# EAGLE design PhD_HAT_Pi (EAGLE 9.4.1)

## Sheet 1 of 2
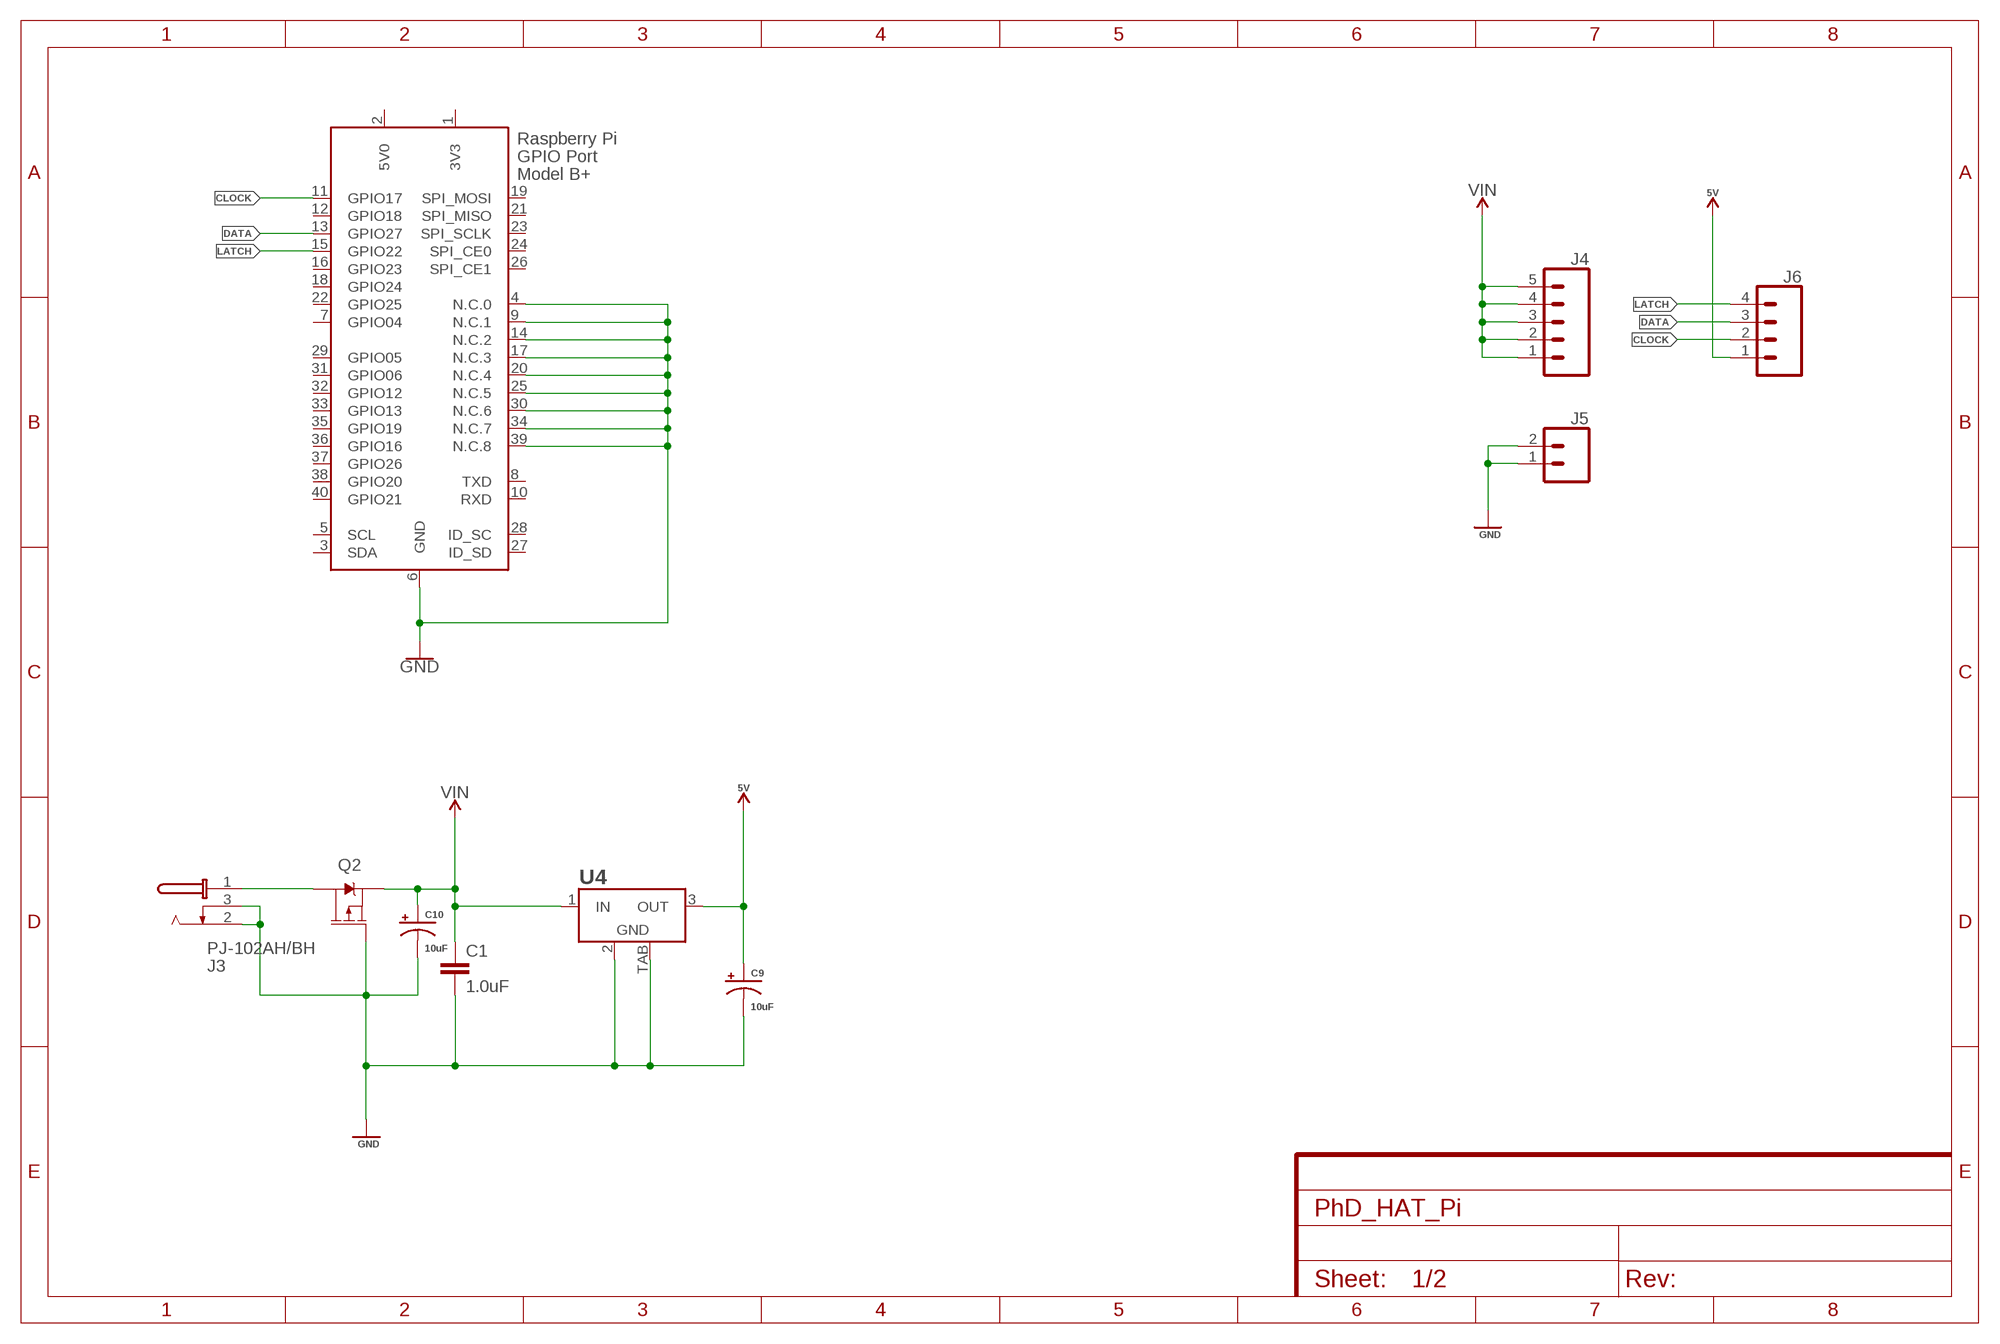
[diagram p0: schematic, sheet 1]

### Parts
C1  1.0uF  1.0UF-0603-16V-10%  [0603]
C9  10uF  10UF-POLAR-EIA3216-16V-10%(TANT)  [EIA3216]
C10  10uF  10UF-POLAR-EIA3216-16V-10%(TANT)  [EIA3216]
J3  PJ-102AH/BH  [PJ-102XH]
J4  CONN_05SCREW  [SCREWTERMINAL-3.5MM-5]
J5  CONN_023.5MM  [SCREWTERMINAL-3.5MM-2]
J6  CONN_04SCREW  [SCREWTERMINAL-3.5MM-4]
Q2  2.5A/30V/105mΩ  MOSFET_PCH-DMG2307L  [SOT23-3]
U4  MIC39100-5.0WS  [SOT223]
X1  RASPI_BOARD_B+_H  [RASPI_BOARD_B+HAT]

### Nets
5V: C9.+ J6.1 U4.3(OUT)
CLOCK: J6.2 X1.11(GPIO17)
DATA: J6.3 X1.13(GPIO27)
GND: C1.2 C9.- C10.- J3.2(S) J3.3(SS) J5.1 J5.2 Q2.1(G) U4.2(GND) U4.TAB(GND) X1.4(N.C.0) X1.6(GND) X1.9(N.C.1) X1.14(N.C.2) X1.17(N.C.3) X1.20(N.C.4) X1.25(N.C.5) X1.30(N.C.6) X1.34(N.C.7) X1.39(N.C.8)
LATCH: J6.4 X1.15(GPIO22)
N$9: J3.1(T) Q2.3(D)
VIN: C1.1 C10.+ J4.1 J4.2 J4.3 J4.4 J4.5 Q2.2(S) U4.1(IN)
Unconnected: X1.3(SDA) X1.5(SCL) X1.7(GPIO04) X1.8(TXD) X1.10(RXD) X1.12(GPIO18) X1.16(GPIO23) X1.18(GPIO24) X1.19(SPI_MOSI) X1.21(SPI_MISO) X1.22(GPIO25) X1.23(SPI_SCLK) X1.24(SPI_CE0) X1.26(SPI_CE1) X1.27(ID_SD) X1.28(ID_SC) X1.29(GPIO05) X1.31(GPIO06) X1.32(GPIO12) X1.33(GPIO13) X1.35(GPIO19) X1.36(GPIO16) X1.37(GPIO26) X1.38(GPIO20) X1.40(GPIO21)

## Sheet 2 of 2
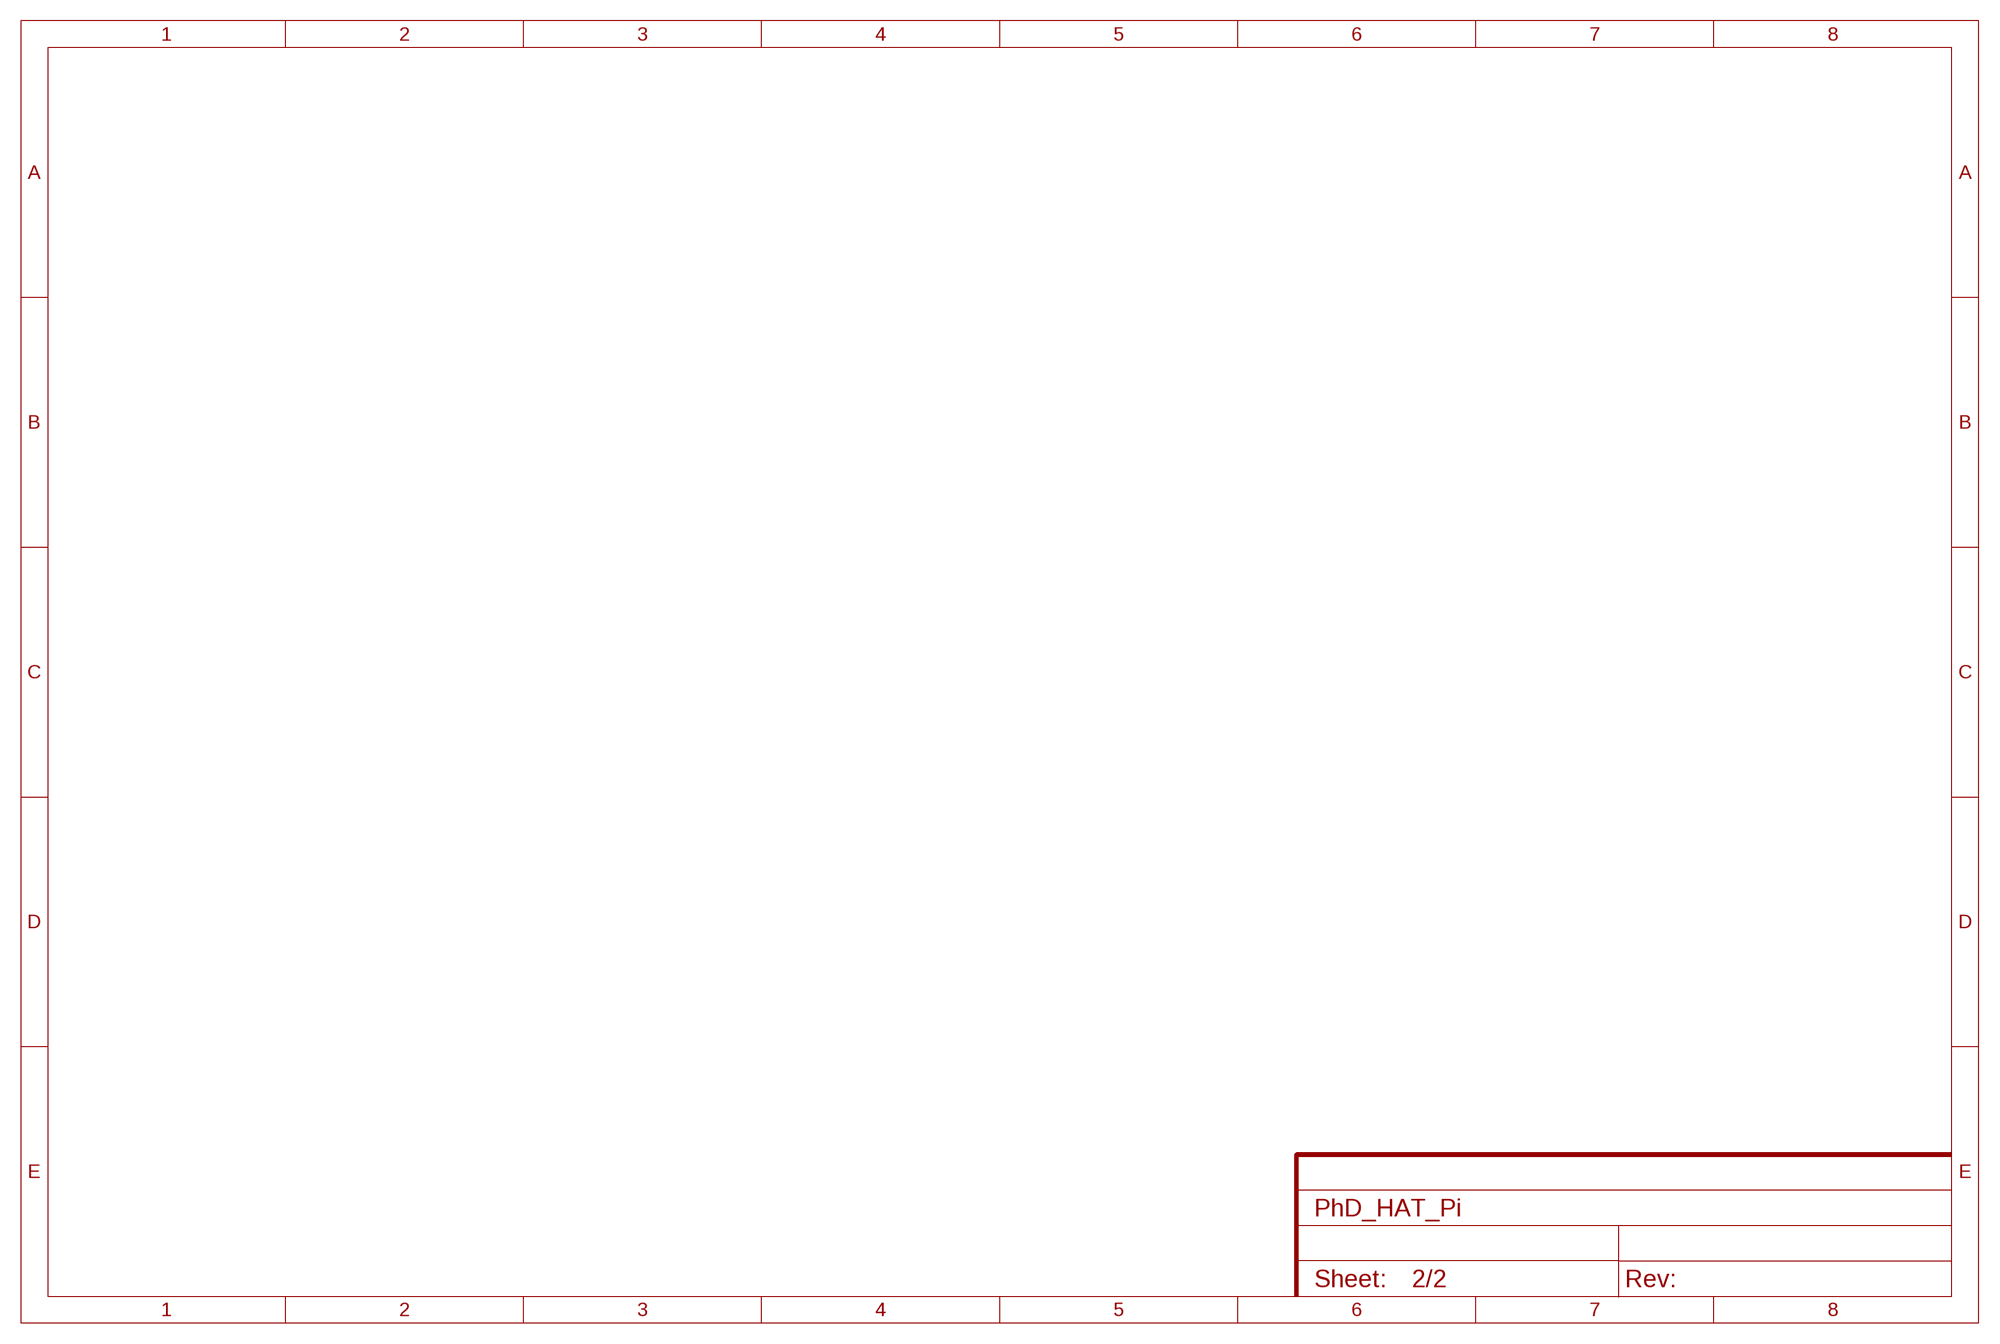
[diagram p1: schematic, sheet 2]

## Power pins joined to a net without a drawn wire
3V3: X1.1(3V3)
5V0: X1.2(5V0)

## Library data of the parts
C1 = SparkFun-Capacitors:1.0UF: 1µF ceramic capacitors A capacitor is a passive two-terminal electrical component used to store electrical energy temporarily in an electric field.; PROD_ID: CAP-00868
C9 C10 = SparkFun-Capacitors:10UF-POLAR: 10.0µF polarized capacitors A capacitor is a passive two-terminal electrical component used to store electrical energy temporarily in an electric field.; PROD_ID: CAP-00811
J3 = con-cuistack:PJ-102AH/BH: DC Power Jack PJ-102AH (2.1 x 5.5 MM) PJ-102BH (2.5 x 5.5 MM)
J4 = SparkFun-Connectors:CONN_05: Multi connection point. Often used as Generic Header-pin footprint for 0.1 inch spaced/style header connections On any of the 0.1 inch spaced packages, you can populate with these: Break Away Headers - Straight <https://www.sparkfun.com/products/116> (PRT-00116) Break Away Male Headers - Right Angle <https://www.sparkfun.com/products/553> (PRT-00553) Female Headers <https://www.sparkfun.com/products/115> (PRT-00115) Break Away Headers - Machine Pin <https://www.sparkfun.com/products/117> (PRT-00117) Break Away Female Headers - Swiss Machine Pin <https://www.sparkfun.com/products/743> (PRT-00743) For SCREWTERMINALS and SPRING TERMINALS visit here: Screw Terimnals on SparkFun.com <https://www.sparkfun.com/search/results?term=Screw+Terminals> (5mm/3.5mm/2.54mm spacing) This device is also useful as a general connection point to wire up your design to another part of your project. Our various solder wires solder well into these plated through hole pads. Hook-Up Wire - Assortment (Stranded, 22 AWG) <https://www.sparkfun.com/products/11375> (PRT-11375) Hook-Up Wire - Assortment (Solid Core, 22 AWG) <https://www.sparkfun.com/products/11367> (PRT-11367) View the entire wire category on our website here <https://www.sparkfun.com/categories/141> Special notes: Molex polarized connector foot print use with SKU : PRT-08231 with associated crimp pins and housings. 1MM SMD Version SKU: PRT-10208; PROD_ID: Combine 8288+8399
J5 = SparkFun-Connectors:CONN_02: Multi connection point. Often used as Generic Header-pin footprint for 0.1 inch spaced/style header connections On any of the 0.1 inch spaced packages, you can populate with these: Break Away Headers - Straight <https://www.sparkfun.com/products/116> (PRT-00116) Break Away Male Headers - Right Angle <https://www.sparkfun.com/products/553> (PRT-00553) Female Headers <https://www.sparkfun.com/products/115> (PRT-00115) Break Away Headers - Machine Pin <https://www.sparkfun.com/products/117> (PRT-00117) Break Away Female Headers - Swiss Machine Pin <https://www.sparkfun.com/products/743> (PRT-00743) For SCREWTERMINALS and SPRING TERMINALS visit here: Screw Terimnals on SparkFun.com <https://www.sparkfun.com/search/results?term=Screw+Terminals> (5mm/3.5mm/2.54mm spacing) This device is also useful as a general connection point to wire up your design to another part of your project. Our various solder wires solder well into these plated through hole pads. Hook-Up Wire - Assortment (Stranded, 22 AWG) <https://www.sparkfun.com/products/11375> (PRT-11375) Hook-Up Wire - Assortment (Solid Core, 22 AWG) <https://www.sparkfun.com/products/11367> (PRT-11367) View the entire wire category on our website here <https://www.sparkfun.com/categories/141> Special notes: Molex polarized connector foot print use with: PRT-08233 with associated crimp pins and housings. 2.54_SCREWTERM for use with PRT-10571. 3.5mm Screw Terminal footprints for PRT-08084 5mm Screw Terminal footprints for use with PRT-08432; PROD_ID: CONN-08399
J6 = SparkFun-Connectors:CONN_04: Multi connection point. Often used as Generic Header-pin footprint for 0.1 inch spaced/style header connections On any of the 0.1 inch spaced packages, you can populate with these: Break Away Headers - Straight <https://www.sparkfun.com/products/116> (PRT-00116) Break Away Male Headers - Right Angle <https://www.sparkfun.com/products/553> (PRT-00553) Female Headers <https://www.sparkfun.com/products/115> (PRT-00115) Break Away Headers - Machine Pin <https://www.sparkfun.com/products/117> (PRT-00117) Break Away Female Headers - Swiss Machine Pin <https://www.sparkfun.com/products/743> (PRT-00743) For SCREWTERMINALS and SPRING TERMINALS visit here: Screw Terimnals on SparkFun.com <https://www.sparkfun.com/search/results?term=Screw+Terminals> (5mm/3.5mm/2.54mm spacing) This device is also useful as a general connection point to wire up your design to another part of your project. Our various solder wires solder well into these plated through hole pads. Hook-Up Wire - Assortment (Stranded, 22 AWG) <https://www.sparkfun.com/products/11375> (PRT-11375) Hook-Up Wire - Assortment (Solid Core, 22 AWG) <https://www.sparkfun.com/products/11367> (PRT-11367) View the entire wire category on our website here <https://www.sparkfun.com/categories/141> Special notes: Molex polarized connector foot print use with SKU : PRT-08231 with associated crimp pins and housings. 1MM SMD Version SKU: PRT-10208; PROD_ID: 2xCONN-08399; SF_ID: 2xPRT-08084
Q2 = SparkFun-DiscreteSemi:MOSFET_PCH: P-channel MOSFETs Voltage controlled devices that allow control of high current outputs. SparkFun Products: SparkFun ESP32 Thing <https://www.sparkfun.com/products/13907> SparkFun ESP8266 Thing <https://www.sparkfun.com/products/13231>; PROD_ID: TRANS-11308
U4 = MIC39100-5.0WS:MIC39100-5.0WS; AVAILABILITY: Unavailable; DESCRIPTION: LDO Regulator Pos 5V 1A; MF: Micrel; MP: MIC39100-5.0WS; PACKAGE: SOT-223 Micrel; PRICE: None
X1 = raspberrypi_bastelstube_v13:RASPI_BOARD_B+: Raspberry Pi GPIO connector with markings for the outer dimensions of the Raspberry Pi board model B+ with different sets of drill holes or mounting pads

## Board
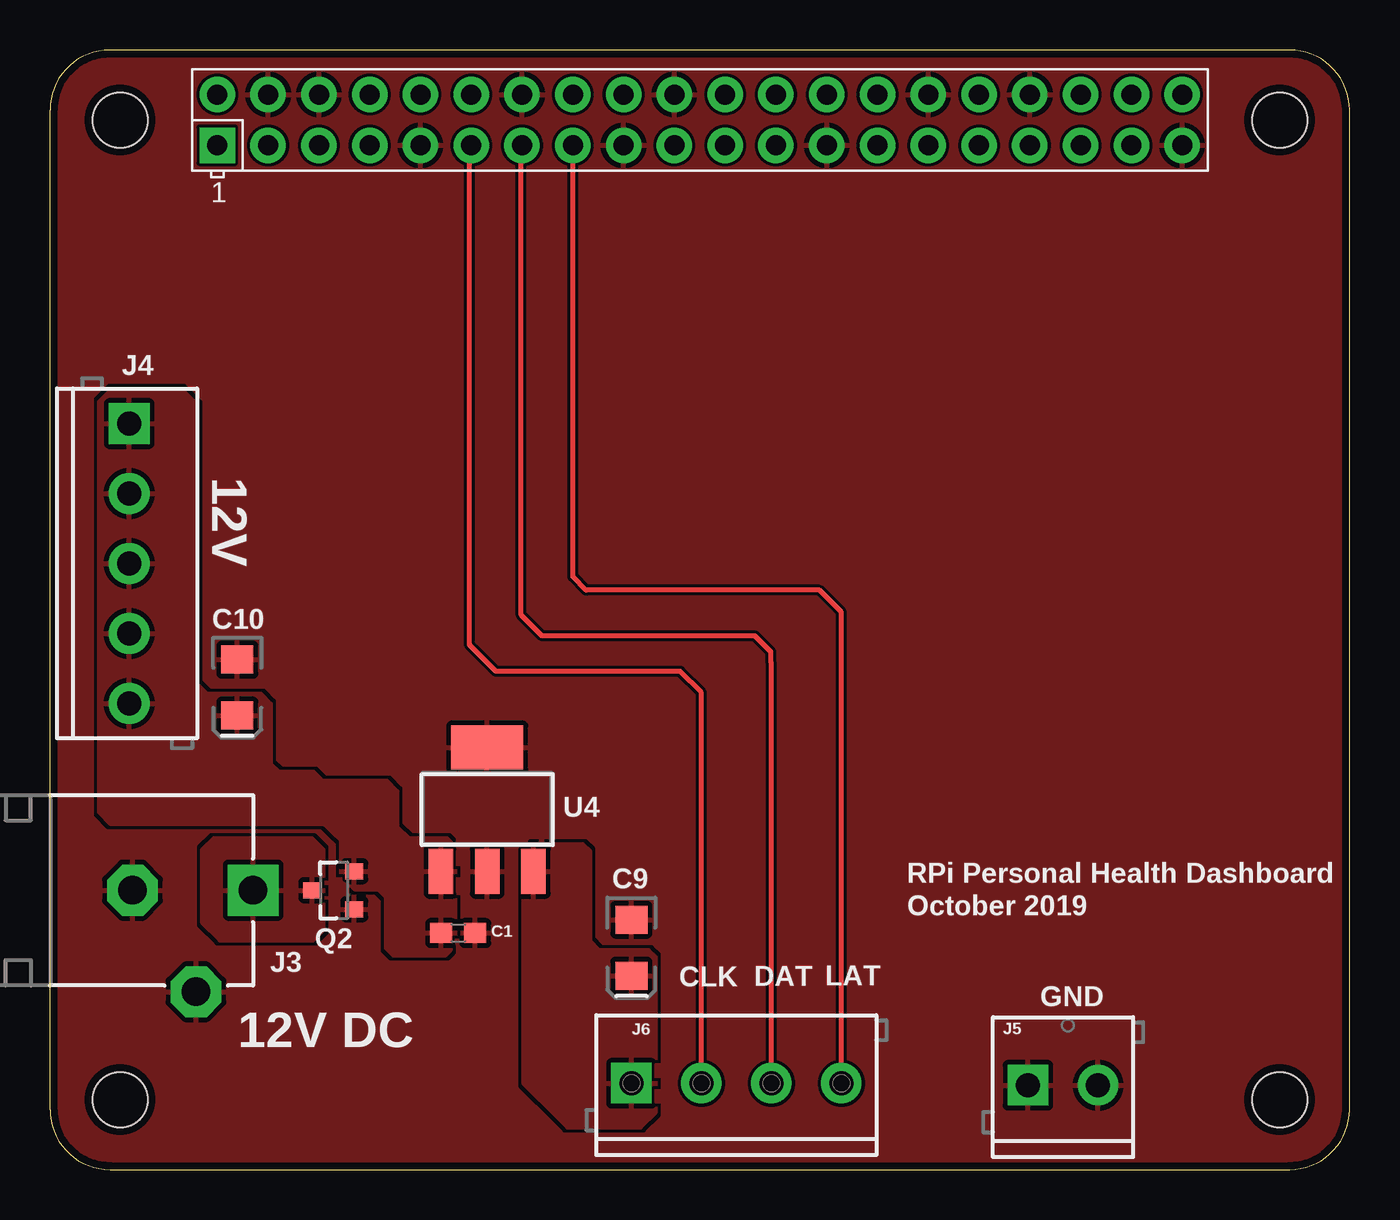
[diagram p2: board, top side]
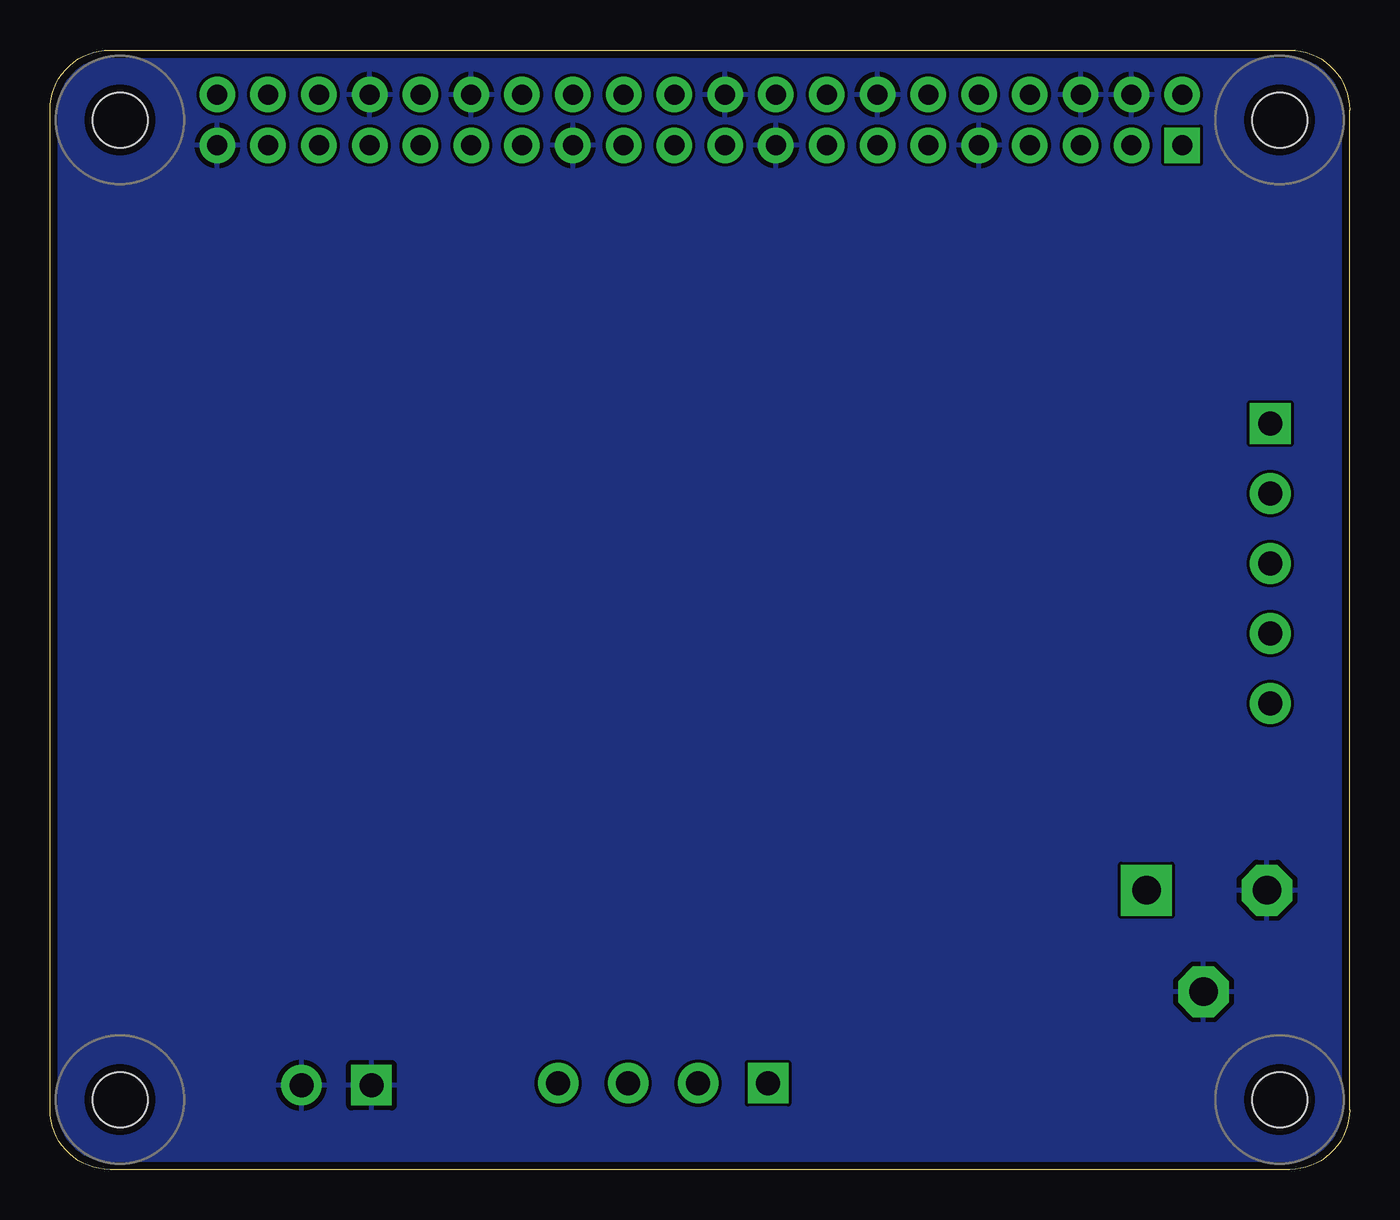
[diagram p3: board, bottom side, seen from below]

Size 65 x 56 mm. Coordinates in mm from the lower left corner, seen from the top.
Copper layers (1*16): Top 0.035559375mm / dielectric 1.6mm / Bottom 0.035559375mm
Design rules "oshpark-2layer": minimum track width 6mil, minimum drill 10mil, track to track 6mil, track to pad 6mil, pad to pad 6mil, via to via 6mil, smd to smd 6mil, copper to edge 15mil, drill to drill 6mil, minimum pad ring 5mil, minimum via ring 5mil, stop-mask expansion 2.5mil, vias tented up to drill 0mil, thermal gap 10mil

### Footprints (pad centres in the part's own frame; a part is rotated, then mirrored left to right if it is on the bottom)
0603 = smd 1.1 x 1: 1 -0.85,0; 2 0.85,0
EIA3216 = smd 1.4 x 1.6: + 1.4,0; - -1.4,0
PJ-102XH = drill 1.422 pad 2.54 square: 1 0,0 | drill 1.422 pad 2.54 octagon: 2 0,-6.032; 3 5.08,-2.857
SCREWTERMINAL-3.5MM-5 = drill 1.2 pad 2.032 square: 1 0,0 | drill 1.2 pad 2.032: 2 3.5,0; 3 7,0; 4 10.5,0; 5 14,0
SCREWTERMINAL-3.5MM-2 = drill 1.2 pad 2.032 square: 1 0,0 | drill 1.2 pad 2.032: 2 3.5,0
SCREWTERMINAL-3.5MM-4 = drill 1.2 pad 2.032 square: 1 0,0 | drill 1.2 pad 2.032: 2 3.5,0; 3 7,0; 4 10.5,0
SOT23-3 = smd 0.8 x 0.9: 1 -0.95,-1; 2 0.95,-1; 3 0,1.1
SOT223 = smd 1.219 x 2.235: 1 -2.311,-3.099; 2 0,-3.099; 3 2.311,-3.099 | smd 3.6 x 2.2: TAB 0,3.099
RASPI_BOARD_B+HAT = drill 1 pad 1.778 square: 1 8.37,51.23 | drill 1 pad 1.778: 2 8.37,53.77; 3 10.91,51.23; 4 10.91,53.77; 5 13.45,51.23; 6 13.45,53.77; 7 15.99,51.23; 8 15.99,53.77; 9 18.53,51.23; 10 18.53,53.77; 11 21.07,51.23; 12 21.07,53.77; 13 23.61,51.23; 14 23.61,53.77; 15 26.15,51.23; 16 26.15,53.77; 17 28.69,51.23; 18 28.69,53.77; 19 31.23,51.23; 20 31.23,53.77; 21 33.77,51.23; 22 33.77,53.77; 23 36.31,51.23; 24 36.31,53.77; 25 38.85,51.23; 26 38.85,53.77; 27 41.39,51.23; 28 41.39,53.77; 29 43.93,51.23; 30 43.93,53.77; 31 46.47,51.23; 32 46.47,53.77; 33 49.01,51.23; 34 49.01,53.77; 35 51.55,51.23; 36 51.55,53.77; 37 54.09,51.23; 38 54.09,53.77; 39 56.63,51.23; 40 56.63,53.77 | hole 2.75: 3.5,3.5; 3.5,52.5; 61.5,3.5; 61.5,52.5

### Placement (x,y rotation side)
C1  20.42,11.84 0 top
C9  29.08,11.1 270 top
C10  9.37,24.1 270 top
J3  10.16,13.97 270 top
J4  3.96,37.31 270 top
J5  48.92,4.22 0 top
J6  29.08,4.32 0 top
Q2  14.22,13.97 90 top
U4  21.87,18.01 0 top
X1  0,0 0 top

### Tracks (layer width: path | path; a pad name or v marks a point on that pad's centre or on a via)
5V
  pour Top: 25.4,2.54 25.86,2.08 29.57,2.08 30.33,2.84 30.33,10.64 29.97,11 29.34,11 27.48,11 27.05,11.43 27.05,15.93 26.7,16.28 24.13,16.28 24.08,16.23 23.65,15.8 23.65,15.75 23.65,4.29
CLOCK
  Top 0.254: J6.2 32.58,23.86 31.52,24.92 22.3,24.92 20.98,26.24 20.98,51.14 X1.11
DATA
  Top 0.254: X1.13 23.57,51.19 23.57,27.74 24.61,26.7 35.26,26.7 36.05,25.89 36.05,25.4 36.05,4.35 J6.3
GND
  pour Top (rank 6): 0,0 65.02,0 65.02,54.61 65.02,55.93 58.55,55.93 0,55.93
  pour Bottom (rank 6): 0,0 65.02,0 65.02,55.91 0,55.91
LATCH
  Top 0.254: J6.4 39.58,27.88 38.48,28.98 26.82,28.98 26.15,29.65 X1.15
N$9
  pour Top: 8.89,11.43 11.43,11.43 13.18,11.43 13.36,11.61 13.72,11.96 13.72,12.19 13.72,16 13.13,16.59 8.15,16.59 7.57,16 7.57,12.34 8.46,11.46 8.48,11.43
VIN
  pour Top: 15.24,13.97 14.61,14.61 14.53,14.61 14.53,16.43 14.15,16.81 13.72,17.25 9.35,17.25 3.02,17.25 2.44,17.83 2.44,38.43 3.1,39.09 6.58,39.09 7.39,38.28 7.39,24.31 7.87,23.83 10.57,23.83 11.07,23.32 11.07,20.32 11.46,19.94 13.18,19.94 13.64,19.48 16.87,19.48 17.4,18.95 17.4,17.17 17.96,16.61 19.86,16.61 20.29,16.18 20.29,11.18 19.79,10.67 17.17,10.67 16.79,11.05 16.79,13.08 16.79,13.59 16.48,13.89 16.41,13.97

### Text on the board
tNames: 12V | RPi Personal Health Dashboard | October 2019 | CLK | DAT | LAT | GND | 12V DC